# EasyEDA Pro project ProPrj_PFC_1_2025-03-30.epro

# Schematic Schematic1
Board Name: Board1; Create Date: 2025-03-03; Page Name: P1; Project Name: PFC_1; Schematic Name: Schematic1; Update Date: 2025-03-08; Company: 嘉立创EDA; Page Size: A4; Version: V1.0
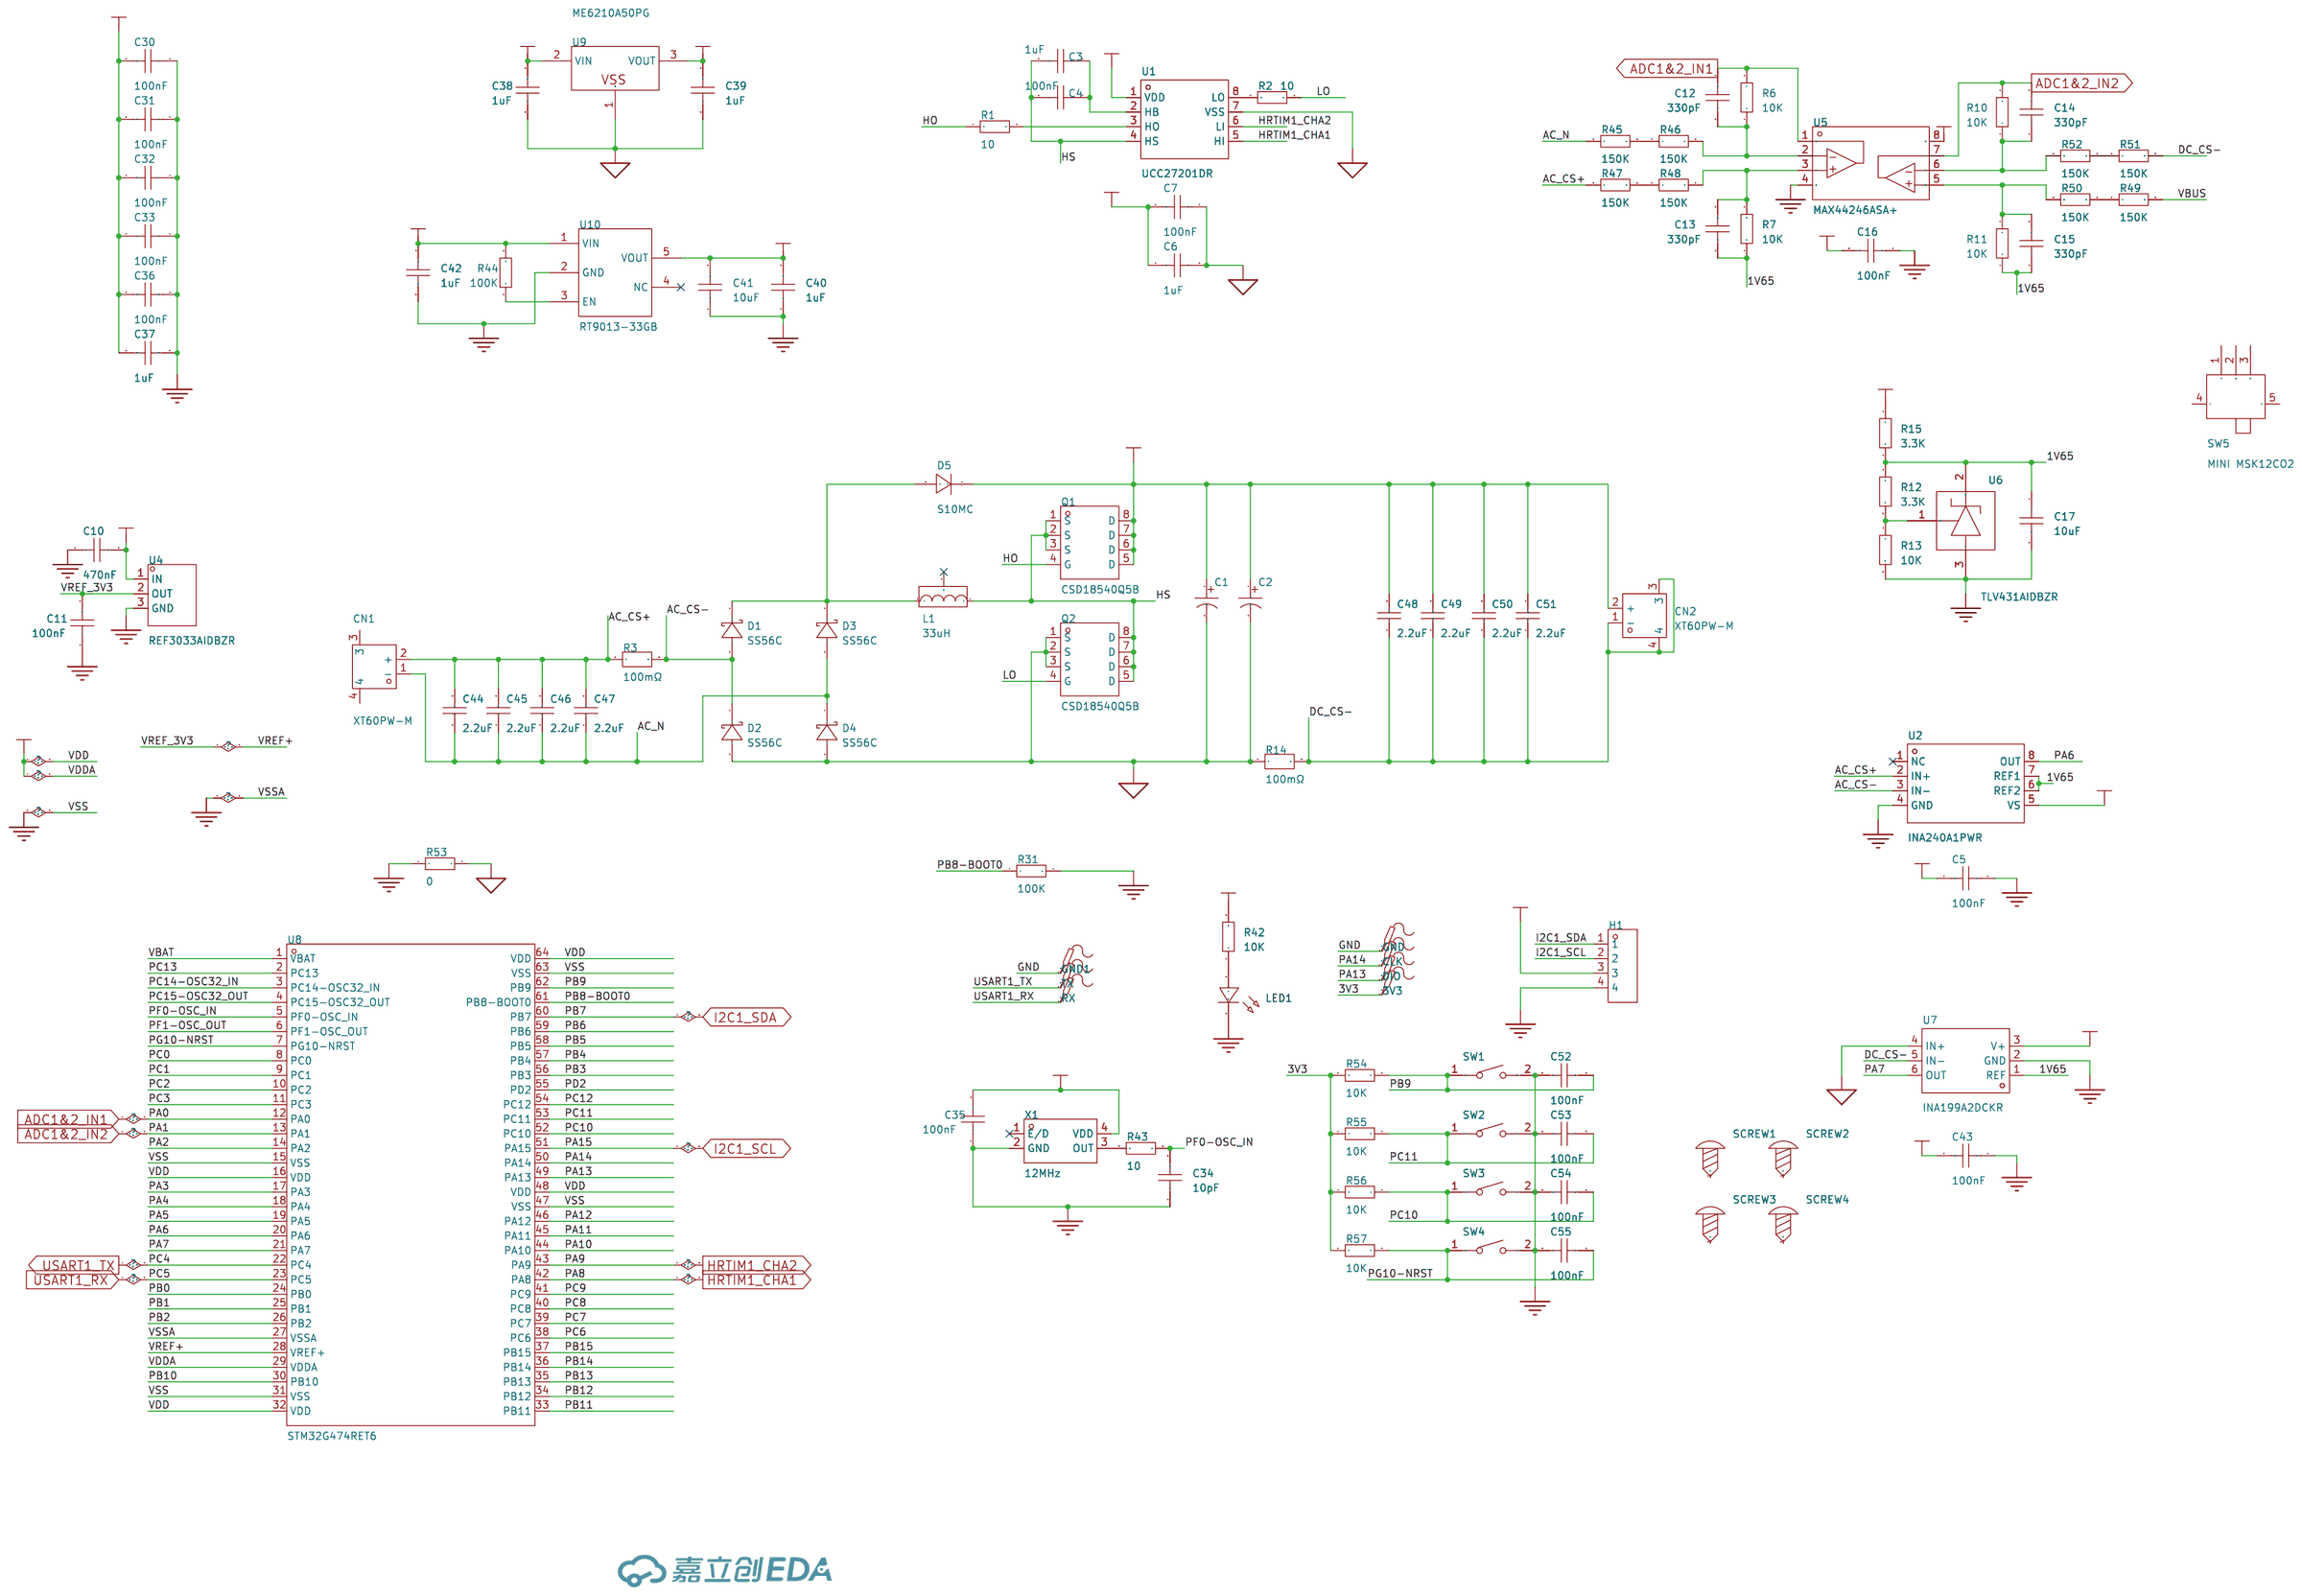
[diagram p0: schematic sheet]

## Parts
3V3  -  [Test-Point-0.5mm]
C1  680uF  [CAP-TH_BD12.5-P5.00-D0.6-FD]
C2  680uF  [CAP-TH_BD12.5-P5.00-D0.6-FD]
C3  1uF  [C0603]
C4  100nF  [C0603]
C5  100nF  [R0402]
C6  1uF  [C0603]
C7  100nF  [C0603]
C10  470nF  [R0402]
C11  100nF  [R0402]
C12  330pF  [R0402]
C13  330pF  [R0402]
C14  330pF  [R0402]
C15  330pF  [R0402]
C16  100nF  [R0402]
C17  10uF  [R0402]
C30  100nF  [R0402]
C31  100nF  [R0402]
C32  100nF  [R0402]
C33  100nF  [R0402]
C34  10pF  [R0402]
C35  100nF  [R0402]
C36  100nF  [R0402]
C37  1uF  [R0402]
C38  1uF  [C0603]
C39  1uF  [C0603]
C40  1uF  [C0603]
C41  10uF  [C0603]
C42  1uF  [C0603]
C43  100nF  [R0402]
C44  2.2uF  [C1206]
C45  2.2uF  [C1206]
C46  2.2uF  [C1206]
C47  2.2uF  [C1206]
C48  2.2uF  [C1206]
C49  2.2uF  [C1206]
C50  2.2uF  [C1206]
C51  2.2uF  [C1206]
C52  100nF  [R0402]
C53  100nF  [R0402]
C54  100nF  [R0402]
C55  100nF  [R0402]
CLK  -  [Test-Point-0.5mm]
CN1  XT60PW-M  [CONN-TH_XT60PW-M]
CN2  XT60PW-M  [CONN-TH_XT60PW-M]
D1  SS56C  [SMC_L6.9-W5.9-LS7.9-RD]
D2  SS56C  [SMC_L6.9-W5.9-LS7.9-RD]
D3  SS56C  [SMC_L6.9-W5.9-LS7.9-RD]
D4  SS56C  [SMC_L6.9-W5.9-LS7.9-RD]
D5  S10MC  [SMC_L7.1-W6.2-LS8.1-RD]
DIO  -  [Test-Point-0.5mm]
GND  -  [Test-Point-0.5mm]
GND1  -  [Test-Point-0.5mm]
H1  -  [HDR-TH_4P-P2.54-V-F]
L1  33uH  [IND-SMD_3P-L27.9-W19.7-P10.43-LS27.9-BL-A]
LED1  -  [LED_0402]
Q1  CSD18540Q5B  [VSON-CLIP-8_L5.0-W6.0-P1.27-BL]
Q2  CSD18540Q5B  [VSON-CLIP-8_L5.0-W6.0-P1.27-BL]
R1  10  [R0603]
R2  10  [R0603]
R3  100mΩ  [RES-SMD_L6.4-W3.2-R2512]
R6  10K  [R0402]
R7  10K  [R0402]
R10  10K  [R0402]
R11  10K  [R0402]
R12  3.3K  [R0402]
R13  10K  [R0402]
R14  100mΩ  [RES-SMD_L6.4-W3.2-R2512]
R15  3.3K  [R0402]
R31  100K  [R0402]
R42  10K  [R0402]
R43  10  [R0402]
R44  100K  [R0402]
R45  150K  [R0603]
R46  150K  [R0603]
R47  150K  [R0603]
R48  150K  [R0603]
R49  150K  [R0603]
R50  150K  [R0603]
R51  150K  [R0603]
R52  150K  [R0603]
R53  0  [R0603]
R54  10K  [R0402]
R55  10K  [R0402]
R56  10K  [R0402]
R57  10K  [R0402]
RX  -  [Test-Point-0.5mm]
SCREW1  -  [M2螺丝]
SCREW2  -  [M2螺丝]
SCREW3  -  [M2螺丝]
SCREW4  -  [M2螺丝]
SW1  TS-1088-AR02016  [SW-SMD_L3.9-W3.0-P4.45]
SW2  TS-1088-AR02016  [SW-SMD_L3.9-W3.0-P4.45]
SW3  TS-1088-AR02016  [SW-SMD_L3.9-W3.0-P4.45]
SW4  TS-1088-AR02016  [SW-SMD_L3.9-W3.0-P4.45]
SW5  MINI MSK12CO2  [SW-SMD_MSK12CO2]
TX  -  [Test-Point-0.5mm]
U1  UCC27201DR  [SOIC-8_L4.9-W3.9-P1.27-LS6.0-BL]
U2  INA240A1PWR  [TSSOP-8_L4.4-W3.0-P0.65-LS6.4-BL]
U4  REF3033AIDBZR  [SOT-23-3_L3.0-W1.7-P0.95-LS2.9-BR]
U5  MAX44246ASA+  [SOIC-8_L4.9-W3.9-P1.27-LS6.0-BL]
U6  TLV431AIDBZR  [SOT-23-3_L2.9-W1.3-P1.90-LS2.4-BR]
U7  INA199A2DCKR  [SOT-363_L2.0-W1.3-P0.65-LS2.1-BR]
U8  STM32G474RET6  [LQFP-64_L10.0-W10.0-P0.50-LS12.0-BL]
U9  ME6210A50PG  [SOT-89-3_L4.5-W2.5-P1.50-LS4.2-BR]
U10  RT9013-33GB  [SOT-23-5_L3.0-W1.7-P0.95-LS2.8-BL]
X1  12MHz  [OSC-SMD_4P-L2.5-W2.0-BL]

## Library data of the parts
3V3 CLK DIO GND GND1 RX TX = Test-Point: Test Point 测试点
C1 C2 = ERR1JM681W25OT: 容值:680uF;精度:±20%;额定电压:63V;; LCSC Part Name: 680uF ±20% 63V; Supplier Part: C106632; Manufacturer: AISHI(艾华集团); Supplier Footprint: 插件,D12.5xL25mm; JLCPCB Part Class: 扩展库; Datasheet: https://atta.szlcsc.com/upload/public/pdf/source/20190702/C401591_1676EF45BC9A88BD1D6B22BBAE3913C7.pdf; Supplier: LCSC; Tolerance: ±20%; Rated Voltage: 63V; Lead Spacing: 5mm; φD: 12.5mm; L: 25mm; Lifetime @ Temp: 2000hrs@105℃
C3 C4 C6 C7 C38-C42 = CAP_0603: Supplier Footprint: 0603
C5 C10-C17 C30-C37 C43 C52-C55 = CAP_0402: Supplier Footprint: 0402
C44-C51 = CL31B225KBHNNNE: 容值:2.2uF;精度:±10%;额定电压:50V;材质(温度系数):X7R;; LCSC Part Name: 2.2uF ±10% 50V; Supplier Part: C50254; Manufacturer: SAMSUNG(三星); Supplier Footprint: 1206; JLCPCB Part Class: 基础库; Datasheet: https://atta.szlcsc.com/upload/public/pdf/source/20160218/1457707763339.pdf; Supplier: LCSC; Tolerance: ±10%; Voltage Rated: 50V; Temperature Coefficient: X7R
CN1 CN2 = XT60PW-M: 类别:-;类型1:-;; LCSC Part Name: AMASS(艾迈斯)航模插头xt60连接器150公母对接pw锂电池公头 板插卧式XT60PW-M; Supplier Part: C98732; Manufacturer: AMASS(艾迈斯); JLCPCB Part Class: 扩展库; Datasheet: https://atta.szlcsc.com/upload/public/pdf/source/20240118/44A3DCFF53BE25DC65378AFFB21277A4.pdf; Supplier: LCSC; Brand: 艾迈斯; Type: 卧式插头; Colour: 黄色; InterfaceType: 公头
D1-D4 = SS56C_C18199187: 二极管配置:独立式;正向压降(Vf):680mV@5A;直流反向耐压(Vr):60V;平均整流电流(Io):5A;; LCSC Part Name: 电压:60V 电流:5A; Supplier Part: C18199187; Manufacturer: 宏迦橙; Supplier Footprint: SMC; JLCPCB Part Class: Extended Part; Datasheet: https://atta.szlcsc.com/upload/public/pdf/source/20230927/46983A3EB8DC257944F6920426E4503D.pdf; Supplier: LCSC; Diode Configuration: 独立式; Forward Voltage (Vf@If): 680mV@5A; Reverse Voltage (Vr): 60V; Average Rectified Current (Io): 5A; Reverse Leakage Current (Ir): 150uA@60V; Peak forward surge current: 120A
D5 = S10MC: 二极管配置:独立式;正向压降(Vf):1V@10A;直流反向耐压(Vr):1kV;整流电流:10A;; LCSC Part Name: 电压:1kV 电流:10A; Supplier Part: C64933; Manufacturer: MDD(辰达半导体); Supplier Footprint: SMC(DO-214AB); JLCPCB Part Class: 扩展库; Datasheet: https://atta.szlcsc.com/upload/public/pdf/source/20230314/1A4EE04768B6F73C910BD0715A0F0DB0.pdf; Supplier: LCSC; Diode Configuration: 独立式; Forward Voltage (Vf@If): 1V@10A; Reverse Voltage (Vr): 1kV; Rectified Current: 10A; Reverse Leakage Current: 5uA@1kV
H1 = HDR-F_2.54_1x4P: Supplier Part: C2718488; Supplier Footprint: 插件
L1 = RSPQ2918-100M: 电感值:10uH;精度:±20%;额定电流:28A;饱和电流(Isat):32.1A;类型:扁平线大电流电感;; LCSC Part Name: 扁线大电流电感; Supplier Part: C32712982; Manufacturer: Ruishen(瑞申电子); Supplier Footprint: SMD-3P,27.9x22.7mm; JLCPCB Part Class: 扩展库; Datasheet: https://atta.szlcsc.com/upload/public/pdf/source/20240726/0174FDFD11BDB39ACD924CDA9AAA1BCF.pdf; Supplier: LCSC; Tolerance: ±20%; Rated Current: 28A; Saturation Current (Isat): 32.1A; DC Resistance (DCR): 2.6mΩ; Type: 扁平线大电流电感
LED1 = LED_0402-B: Supplier Footprint: 0402
Q1 Q2 = CSD18540Q5B: 类型:1个N沟道;漏源电压(Vdss):60V;连续漏极电流(Id):205A;导通电阻(RDS(on)@Vgs,Id):2.6mΩ@10V,28A;功率(Pd):3.8W;阈值电压(Vgs(th)@Id):1.9V@250uA;; LCSC Part Name: 1个N沟道 耐压:60V 电流:205A; Supplier Part: C86513; Manufacturer: TI(德州仪器); Supplier Footprint: VSON-8(5x6); JLCPCB Part Class: 扩展库; Datasheet: https://www.ti.com/lit/ds/symlink/csd18540q5b.pdf?ts=1718590350466&ref_url=https%253A%252F%252Fwww.ti.com.cn%252Fproduct%252Fzh-cn%252FCSD18540Q5B%253FkeyMatch%253DCSD18540Q5B%2526tisearch%253Dsearch-everything%2526usecase%253DOPN; Supplier: LCSC; Type: 1个N沟道; Drain Source Voltage (Vdss): 60V; Continuous Drain Current (Id): 205A; Drain Source On Resistance (RDS(on)@Vgs,Id): 2.6mΩ@10V,28A; Power Dissipation (Pd): 3.8W; Gate Threshold Voltage (Vgs(th)@Id): 1.9V@250uA; Total Gate Charge (Qg@Vgs): 41nC@10V; Input Capacitance (Ciss@Vds): 4.23nF@30V; Reverse Transfer Capacitance (Crss@Vds): 20pF@30V; Operating Temperature: -55℃~+175℃
R1 R2 R45-R53 = Res_0603: Supplier Footprint: 0603
R3 R14 = HoJLR2512-3W-100mR-1%: 电阻类型:采样电阻;阻值:100mΩ;精度:±1%;功率:3W;安装方式:贴片;; LCSC Part Name: 100mΩ ±1% 3W; Supplier Part: C2903476; Manufacturer: Milliohm(毫欧); Supplier Footprint: 2512; JLCPCB Part Class: 扩展库; Datasheet: https://atta.szlcsc.com/upload/public/pdf/source/20211009/7525CABAB363C979E942C1DD41F1FEF0.pdf; Supplier: LCSC; Type: 采样电阻; Tolerance: ±1%; Power(Watts): 3W; Mounting Sytle: 贴片
R6 R7 R10-R13 R15 R31 R42-R44 R54-R57 = Res_0402: Supplier Footprint: 0402
SCREW1-SCREW4 = M2螺丝: Supplier Footprint: 插件
SW1-SW4 = TS-1088-AR02016: 电路结构:单刀单掷;按钮形状:圆形按钮;作用力:160gf;安装方式:立贴;开关长度:4mm;开关宽度:3mm;开关高度:2mm;带支架:不带;触点电流:50mA;额定电压(DC):12V;绝缘电阻:100MΩ;机械寿命:10万次;; LCSC Part Name: 4*3*2mm 立贴 轻触开关; Supplier Part: C720477; Manufacturer: XUNPU(讯普); Supplier Footprint: SMD; JLCPCB Part Class: 扩展库; Datasheet: https://atta.szlcsc.com/upload/public/pdf/source/20200810/C720475_60D09DD6C54279ADDB2DC25100F1CC11.pdf; Supplier: LCSC; Circuit: 单刀单掷; Actuator Style: 圆形按钮; Operating Force: 160gf; Mounting Style: 立贴; Switch Length: 4mm; Switch Width: 3mm; Switch Height: 2mm; Strike Gundam: 不带; Contact Current: 50mA; Voltage Rating (DC): 12V; Insulation Resistance: 100MΩ; Actuator/Cap Color: 黑色; Pin Style: SMD接片; Mechanical Life: 10万次; Operating Temperature: -30℃~+80℃
SW5 = MINI MSK12CO2: 电路结构:单刀双掷;安装方式:卧贴;开关颜色:-;额定电流(DC):50mA;额定电压(DC):12V;额定电流(AC):-;额定电压(AC):-;机械寿命:1万次;; LCSC Part Name: 迷你七脚两档侧拨拨动 mini七7脚 微型拨动; Supplier Part: C2681570; Manufacturer: SHOU HAN(首韩); Supplier Footprint: SMD; JLCPCB Part Class: 扩展库; Datasheet: https://atta.szlcsc.com/upload/public/pdf/source/20210224/C2681570_D263F9C605E4588A4AE6114B72AE4C72.pdf; Supplier: LCSC; Circuit: 单刀双掷; Pin Style: SMD接片; Switch Length: 5mm; Switch Width: 2.75mm; Switch Height: 1.4mm; Mounting Style: 卧贴; Current Rating (DC): 50mA; Voltage Rating (DC): 12V; Mechanical Life: 1万次; Operating Temperature: -16℃~+60℃
U1 = UCC27201DR: 驱动配置:半桥;负载类型:MOSFET;驱动通道数:2;峰值灌电流:3A;峰值拉电流:3A;电源电压:8V~17V;上升时间:8ns;下降时间:7ns;; Supplier Part: C47661; Manufacturer: TI(德州仪器); Supplier Footprint: SOIC-8; JLCPCB Part Class: 扩展库; Datasheet: https://www.ti.com/cn/lit/gpn/ucc27201; Supplier: LCSC; Driven Configuration: 半桥; Load Type: MOSFET; Number of Drivers: 2; Peak Output Current(sink): 3A; Peak Output Current(source): 3A; Supply Voltage: 8V~17V; Rise Time: 8ns; Fall Time: 7ns; Operating Temperature: -40℃~+140℃@(Tj)
U2 = INA240A1PWR: 放大器数:单路;; Supplier Part: C93965; Manufacturer: TI(德州仪器); Supplier Footprint: TSSOP-8; JLCPCB Part Class: 扩展库; Datasheet: https://www.ti.com/cn/lit/gpn/ina240; Supplier: LCSC; Number of Channels: 单路; Supply Current: 1.8mA; Operating Temperature: -40℃~+125℃
U4 = REF3033AIDBZR: 输出类型:固定;输入电压:3.35V~5.5V;输出电压:3.3V;输出电流:25mA;精度:±0.2%;; Supplier Part: C36658; Manufacturer: TI(德州仪器); Supplier Footprint: SOT-23; JLCPCB Part Class: 扩展库; Datasheet: https://www.ti.com/cn/lit/gpn/ref3020; Supplier: LCSC; Output Type: 固定; Input Voltage: 3.35V~5.5V; Output Voltage: 3.3V; Output Current: 25mA; Tolerance: ±0.2%; Temperature Coefficient: 75ppm/℃; Reference Type: 串联; Supply Current: 50uA; Noise - 10Hz to 10kHz: 105uVrms; Operating Temperature: -40℃~+125℃@(Ta)
U5 = MAX44246ASA+: 放大器数:双路;增益带宽积(GBP):5MHz;输入偏置电流(Ib):300pA;压摆率(SR):3.8V/us;带宽(-3db):-;轨到轨:-;; LCSC Part Name: MAX44246ASA; Supplier Part: C143473; Manufacturer: ADI(亚德诺)/MAXIM(美信); Supplier Footprint: SOIC-8; JLCPCB Part Class: 扩展库; Datasheet: https://atta.szlcsc.com/upload/public/pdf/source/20190626/C400168_58539801ADE717E00F7AF2A27F952E63.pdf; Supplier: LCSC; Number of Circuits: 双路; Gain Bandwidth Product(GBP): 5MHz; Current - Input Bias(Ib): 300pA; Slew Rate(SR): 3.8V/us; Output Current: 40mA; Operating Temperature: -40℃~+125℃
U6 = TLV431AIDBZR: 输出类型:可调;输出电压:1.24V~6V;输出电流:15mA;精度:±1%;; Supplier Part: C56765; Manufacturer: TI(德州仪器); Supplier Footprint: SOT-23; JLCPCB Part Class: 扩展库; Datasheet: https://www.ti.com/cn/lit/gpn/tlv431a; Supplier: LCSC; Output Type: 可调; Output Voltage: 1.24V~6V; Output Current: 15mA; Tolerance: ±1%; Reference Type: 并联; Minimum Cathode Current for Regulation: 80uA; Operating Temperature: -40℃~+85℃@(TA)
U7 = INA199A2DCKR: INA199 26V、双向电流感应放大器; Supplier Part: C131913; Manufacturer: TI(德州仪器); Supplier Footprint: SOT-363-6; JLCPCB Part Class: 扩展库; Datasheet: https://www.ti.com/cn/lit/gpn/ina199; Supplier: LCSC; Supply Voltage: -300mV~26V; Supply Current: 375uA; Operating Temperature: -40℃~+125℃
U8 = STM32G474RET6: CPU内核:ARM-M4;程序存储容量:512KB;RAM总容量:128KB;GPIO端口数量:52;工作电压范围:1.71V~3.6V;CPU最大主频:170MHz;程序存储器类型:FLASH;; LCSC Part Name: 带DSP和FPU的170MHz主流ARM Cortex-M4 MCU，具有512 KB Flash存储器、数学加速器、高分辨率定时器和高模拟电平集成; Supplier Part: C521608; Manufacturer: ST(意法半导体); Supplier Footprint: LQFP-64(10x10); JLCPCB Part Class: 扩展库; Datasheet: https://atta.szlcsc.com/upload/public/pdf/source/20200902/C431632_38212262685EE30B1989689374F08940.pdf; Supplier: LCSC; CPU Core: ARM-M4; Program Storage Size: 512KB; RAM Size: 128KB; GPIO Ports Number: 52; Operating Voltage Range: 1.71V~3.6V; CPU Maximum Speed: 170MHz; Program Memory Type: FLASH; Operating Temperature Range: -40℃~+85℃; ADC (Bit): 12bit; DAC (Bit): 12bit; Peripheral/Function: PWM；PWM; Internal Oscillator: 有
U9 = ME6210A50PG: 输出类型:固定;工作电压:18V;输出电压:5V;输出电流:500mA;电源纹波抑制比(PSRR):-;输出极性:正极;; LCSC Part Name: 输入18V 输出5V 500mA; Supplier Part: C82940; Manufacturer: MICRONE(南京微盟); Supplier Footprint: SOT-89-3; JLCPCB Part Class: 扩展库; Datasheet: https://atta.szlcsc.com/upload/public/pdf/source/20170316/1489630771676.pdf; Supplier: LCSC; Output Type: 固定; Voltage - Supply: 18V; Output Voltage: 5V; Output Current: 500mA; Voltage Dropout: 220mV@(200mA); Features: 短路保护(SCP)；低ESR; Output Configuration: 正极; Number of Outputs: 1
U10 = RT9013-33GB: 输出类型:固定;最大输入电压:5.5V;输出电压:3.3V;最大输出电流:500mA;电源纹波抑制比(PSRR):50dB@(10kHz);输出极性:正极;; LCSC Part Name: 输入5.5V 输出3.3V 500mA; Supplier Part: C47773; Manufacturer: RICHTEK(立锜); Supplier Footprint: SOT-23-5; JLCPCB Part Class: 扩展库; Datasheet: https://atta.szlcsc.com/upload/public/pdf/source/20150504/1457707282459.pdf; Supplier: LCSC; Output Type: 固定; Maximum Input Voltage: 5.5V; Output Voltage: 3.3V; MAX Output Current: 500mA; Power Supply Rejection Ratio (PSRR): 50dB@(10kHz); Dropout Voltage: 400mV@(500mA); standby current: 50uA; Operating Temperature: -40℃~+85℃; Output Polarity: 正极; Number of Outputs: 1
X1 = OT252012MJBA4SL: 频率:12MHz;工作电压:1.8V~3.3V;供电电流:4mA;频率稳定度(全温):±10ppm;; LCSC Part Name: 12MHz ±10ppm 1.8V~3.3V YSO110TR; Supplier Part: C669073; Manufacturer: YXC(扬兴晶振); Supplier Footprint: SMD2520-4P; JLCPCB Part Class: 扩展库; Datasheet: https://atta.szlcsc.com/upload/public/pdf/source/20210329/C669065_30B18CFE780D377BA4E84F6ED1951959.pdf; Supplier: LCSC; Supply Voltage: 1.8V~3.3V; Supply Current (Max): 4mA; Frequency Stability(Full temperature range): ±10ppm; Operating Temperature: -40℃~+85℃

## Nets
1V65: C13.1 C15.1 C17.1 R7.1 R11.1 R12.1 R15.2 U2.6(REF2) U2.7(REF1) U6.2(C) U7.1(REF)
3V3: 3V3.1 C30.2 C31.2 C32.2 C33.2 C35.2 C36.2 C37.2 C40.2 C41.2 R42.2 R54.1 R55.1 R56.1 R57.1 U8.16(VDD) U8.29(VDDA) U8.32(VDD) U8.48(VDD) U8.64(VDD) U10.5(VOUT) X1.4(VDD)
5V0: C5.1 C10.2 C16.2 C39.2 C42.2 C43.1 H1.3 R15.1 R44.2 U2.5(VS) U4.1(IN) U5.8(VDD) U7.3(V+) U9.3(VOUT) U10.1(VIN)
12V0: C6.1 C7.1 C38.2 U1.1(VDD) U9.2(VIN)
AGND: C1.2 C2.2 C6.2 C7.2 C38.1 C39.1 D2.2(A) D4.2(A) Q2.1(S) Q2.2(S) Q2.3(S) R14.1 R53.2 U1.7(VSS) U7.4(IN+) U9.1(VSS)
GND: C5.2 C10.1 C11.1 C16.1 C17.2 C30.1 C31.1 C32.1 C33.1 C34.1 C35.1 C36.1 C37.1 C40.1 C41.1 C42.1 C43.2 C52.1 C53.1 C54.1 C55.1 GND.1 GND1.1 H1.4 LED1.1(C) R13.2 R31.2 R53.1 SW1.2 SW2.2 SW3.2 SW4.2 U2.4(GND) U4.3(GND) U5.4(VSS) U6.3(A) U7.2(GND) U8.15(VSS) U8.27(VSSA) U8.31(VSS) U8.47(VSS) U8.63(VSS) U10.2(GND) X1.2(GND)
VBAT: U8.1(VBAT)
VBUS: C1.1 C2.1 C48.2 C49.2 C50.2 C51.2 CN2.2(+) D5.1(K) Q1.5(D) Q1.6(D) Q1.7(D) Q1.8(D) R49.2
AC_CS+: C44.2 C45.2 C46.2 C47.2 CN1.2(+) R3.1 R47.1 U2.2(IN+)
AC_CS-: D1.2(A) D2.1(K) R3.2 U2.3(IN-)
AC_N: C44.1 C45.1 C46.1 C47.1 CN1.1(-) D3.2(A) D4.1(K) R45.1
ADC1&2_IN1: C12.2 R6.2 U5.1(OUTA) U8.12(PA0)
ADC1&2_IN2: C14.2 R10.2 U5.7(OUTB) U8.13(PA1)
DC_CS-: C48.1 C49.1 C50.1 C51.1 CN2.1(-) CN2.3 CN2.4 R14.2 R51.2 U7.5(IN-)
HO: Q1.4(G) R1.1
HRTIM1_CHA1: U1.5(HI) U8.42(PA8)
HRTIM1_CHA2: U1.6(LI) U8.43(PA9)
HS: C3.1 C4.1 L1.2 Q1.1(S) Q1.2(S) Q1.3(S) Q2.5(D) Q2.6(D) Q2.7(D) Q2.8(D) U1.4(HS)
I2C1_SCL: H1.2 U8.51(PA15)
I2C1_SDA: H1.1 U8.60(PB7)
LO: Q2.4(G) R2.2
PA2: U8.14(PA2)
PA3: U8.17(PA3)
PA4: U8.18(PA4)
PA5: U8.19(PA5)
PA6: U2.8(OUT) U8.20(PA6)
PA7: U7.6(OUT) U8.21(PA7)
PA10: U8.44(PA10)
PA11: U8.45(PA11)
PA12: U8.46(PA12)
PA13: DIO.1 U8.49(PA13)
PA14: CLK.1 U8.50(PA14)
PB0: U8.24(PB0)
PB1: U8.25(PB1)
PB2: U8.26(PB2)
PB3: U8.56(PB3)
PB4: U8.57(PB4)
PB5: U8.58(PB5)
PB6: U8.59(PB6)
PB8-BOOT0: R31.1 U8.61(PB8-BOOT0)
PB9: C52.2 R54.2 SW1.1 U8.62(PB9)
PB10: U8.30(PB10)
PB11: U8.33(PB11)
PB12: U8.34(PB12)
PB13: U8.35(PB13)
PB14: U8.36(PB14)
PB15: U8.37(PB15)
PC0: U8.8(PC0)
PC1: U8.9(PC1)
PC2: U8.10(PC2)
PC3: U8.11(PC3)
PC4: TX.1 U8.22(PC4)
PC5: RX.1 U8.23(PC5)
PC6: U8.38(PC6)
PC7: U8.39(PC7)
PC8: U8.40(PC8)
PC9: U8.41(PC9)
PC10: C54.2 R56.2 SW3.1 U8.52(PC10)
PC11: C53.2 R55.2 SW2.1 U8.53(PC11)
PC12: U8.54(PC12)
PC13: U8.2(PC13)
PC14-OSC32_IN: U8.3(PC14-OSC32_IN)
PC15-OSC32_OUT: U8.4(PC15-OSC32_OUT)
PD2: U8.55(PD2)
PF0-OSC_IN: C34.2 R43.2 U8.5(PF0-OSC_IN)
PF1-OSC_OUT: U8.6(PF1-OSC_OUT)
PG10-NRST: C55.2 R57.2 SW4.1 U8.7(PG10-NRST)
VREF+: C11.2 U4.2(OUT) U8.28(VREF+)
$1N971: R1.2 U1.3(HO)
$1N1088: R2.1 U1.8(LO)
$1N1274: C3.2 C4.2 U1.2(HB)
$1N1915: D1.1(K) D3.1(K) D5.2(A) L1.1
$1N3971: C12.1 R6.1 R46.2 U5.2(INA-)
$1N3972: C13.2 R7.2 R48.2 U5.3(INA+)
$1N3974: C14.1 R10.1 R52.1 U5.6(INB-)
$1N3975: C15.2 R11.2 R50.1 U5.5(INB+)
$1N4175: R12.2 R13.1 U6.1(REF)
$1N6069: R43.1 X1.3(OUT)
$1N8242: R44.1 U10.3(EN)
$1N11631: R45.2 R46.1
$1N11681: R47.2 R48.1
$1N11805: R51.1 R52.2
$1N17930: R49.1 R50.2
$1N24564: LED1.2(A) R42.1

Not connected (* = marked no-connect by the designer): CN1 3 4; L1 3(NC)*; SCREW1 1; SCREW2 1; SCREW3 1; SCREW4 1; SW5 1 2 3 4 5; U2 1(NC)*; U10 4(NC)*; X1 1(E/D)*

# Board PCB1
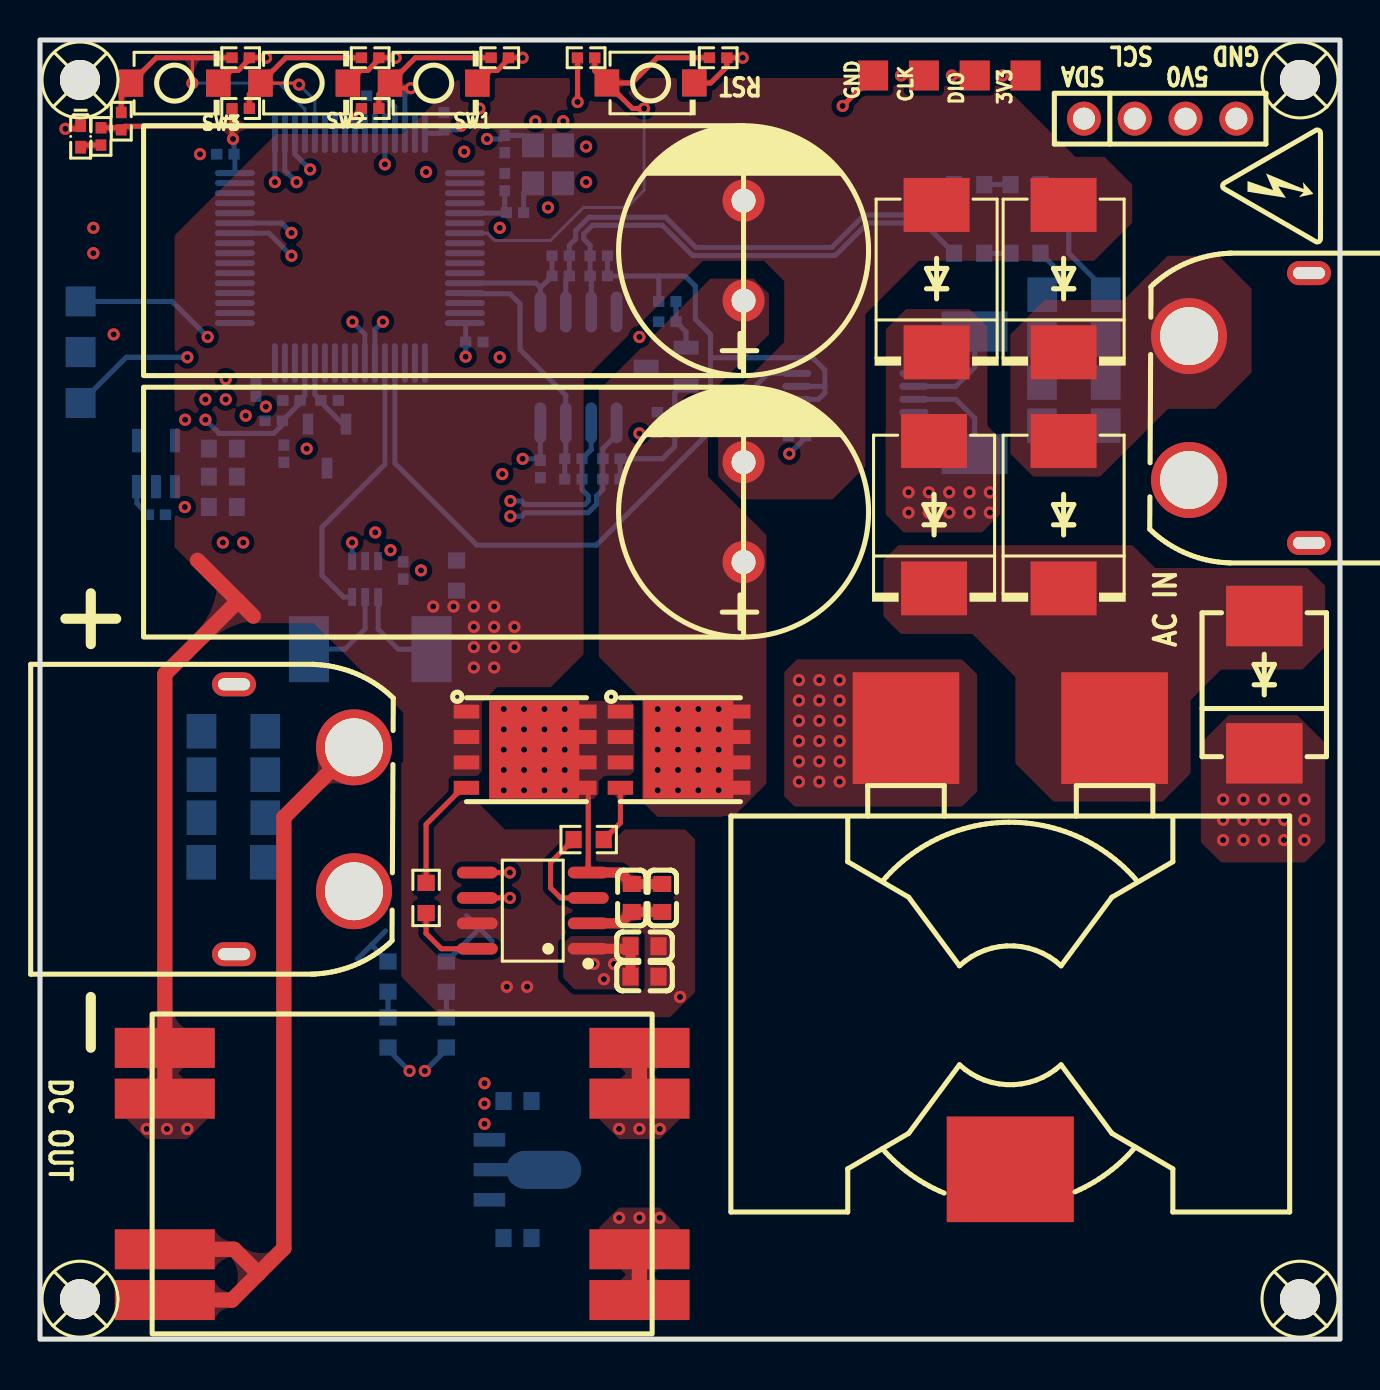
[diagram p1: board, top side]
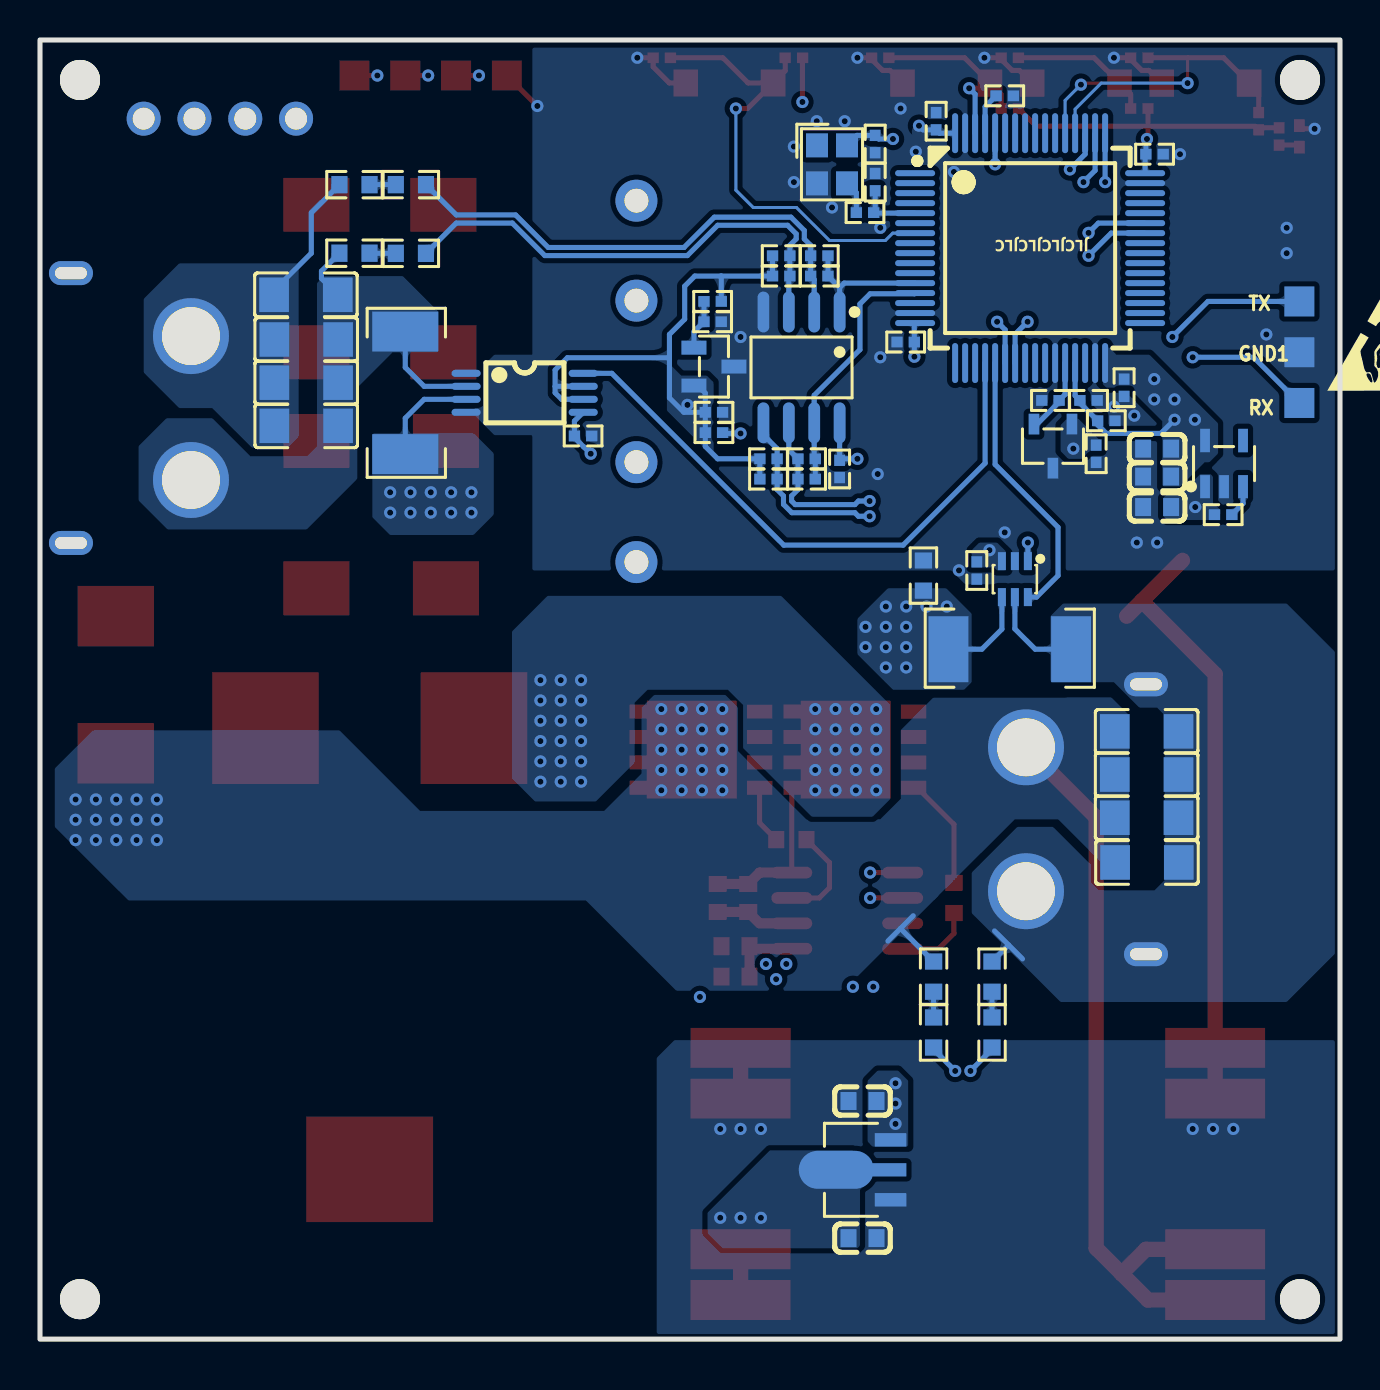
[diagram p2: board, bottom side, seen from below]

Outline 65 x 65 mm; copper layers: Top Layer, Inner1, Inner2, Bottom Layer. Coordinates in mm from the lower left corner of the outline.
Outline path: rectangle 0,65 65,0
Stack: Top Layer 0.035mm 外层铜厚1oz / Dielectric1 0.2104mm 7628 RC49% 8.6mil / Inner1 0.0152mm 内层铜厚 / Dielectric2 1.065mm 1.1mm H/HOZ Copper / Inner2 0.0152mm 内层铜厚 / Dielectric3 0.2104mm 7628 RC49% 8.6mil / Bottom Layer 0.035mm 外层铜厚1oz

## Design rules (mm)
net $1N3971: DP1
net $1N3972: DP1
net $1N3974: DP2
net $1N3975: DP2
template: 自定义配置
spacing copperThickness1oz (default): track to track 0.102, other pairs 0.152 to 0.3
spacing copperThickness2oz: track to track 0.203, other pairs 0.152 to 0.3
track width copperThickness1oz (default): min 0.127, default 0.254, max 2.54
track width copperThickness2oz: min 0.203, default 0.254, max 2.54
differential pair differentialPair (default): width min 0.127, default 0.254, max 2.54; gap min 0.152, default 0.152
via viaSize (default): diameter min 0.5, default 0.61, max 10; hole min 0.3, default 0.305, max 6.3

## Placement (name value [footprint] x y rotation side)
3V3  -  [Test-Point-0.5mm]  49.28 63.22 270 top
C1  680uF  [CAP-TH_BD12.5-P5.00-D0.6-FD]  35.18 54.46 90 top
C2  680uF  [CAP-TH_BD12.5-P5.00-D0.6-FD]  35.18 41.38 90 top
C3  1uF  [C0603]  29.59 22.07 270 top
C4  100nF  [C0603]  31.11 22.07 270 top
C5  100nF  [R0402]  37.85 45.19 180 bottom
C6  1uF  [C0603]  30.23 18.14 0 top
C7  100nF  [C0603]  30.23 19.66 0 top
C10  470nF  [R0402]  12.19 44.3 90 bottom
C11  100nF  [R0402]  14.48 46.97 180 bottom
C12  330pF  [R0402]  26.03 53.19 180 bottom
C13  330pF  [R0402]  27.94 53.19 180 bottom
C14  330pF  [R0402]  26.67 43.03 180 bottom
C15  330pF  [R0402]  28.57 43.03 180 bottom
C16  100nF  [R0402]  25.02 43.54 90 bottom
C17  10uF  [R0402]  31.3 46.37 180 bottom
C30  100nF  [R0402]  20.19 60.94 270 bottom
C31  100nF  [R0402]  21.72 49.89 180 bottom
C32  100nF  [R0402]  9.27 59.28 0 bottom
C33  100nF  [R0402]  10.79 47.6 90 bottom
C34  10pF  [R0402]  23.24 57.89 270 bottom
C35  100nF  [R0402]  23.24 59.79 90 bottom
C36  100nF  [R0402]  12.57 46.97 0 bottom
C37  1uF  [R0402]  11.68 45.95 0 bottom
C38  1uF  [C0603]  23.88 5.06 0 bottom
C39  1uF  [C0603]  23.88 11.91 180 bottom
C40  1uF  [C0603]  9.14 43.16 180 bottom
C41  10uF  [C0603]  9.14 44.55 180 bottom
C42  1uF  [C0603]  9.14 41.63 180 bottom
C43  100nF  [R0402]  18.16 38.46 270 bottom
C44  2.2uF  [C1206]  51.7 52.25 180 bottom
C45  2.2uF  [C1206]  51.69 50.01 180 bottom
C46  2.2uF  [C1206]  51.69 47.86 180 bottom
C47  2.2uF  [C1206]  51.69 45.7 180 bottom
C48  2.2uF  [C1206]  9.65 23.85 0 bottom
C49  2.2uF  [C1206]  9.67 26.09 0 bottom
C50  2.2uF  [C1206]  9.67 28.25 0 bottom
C51  2.2uF  [C1206]  9.67 30.41 0 bottom
C52  100nF  [R0402]  22.99 64.11 180 top
C53  100nF  [R0402]  16.51 64.11 180 top
C54  100nF  [R0402]  10.03 64.11 180 top
C55  100nF  [R0402]  33.91 64.11 180 top
CLK  -  [Test-Point-0.5mm]  44.2 63.22 270 top
CN1  XT60PW-M  [CONN-TH_XT60PW-M]  60.45 46.59 180 top
CN2  XT60PW-M  [CONN-TH_XT60PW-M]  12.7 26.01 0 top
D1  SS56C  [SMC_L6.9-W5.9-LS7.9-RD]  44.7 41.25 90 top
D2  SS56C  [SMC_L6.9-W5.9-LS7.9-RD]  44.83 53.06 90 top
D3  SS56C  [SMC_L6.9-W5.9-LS7.9-RD]  51.18 41.25 90 top
D4  SS56C  [SMC_L6.9-W5.9-LS7.9-RD]  51.18 53.06 90 top
D5  S10MC  [SMC_L7.1-W6.2-LS8.1-RD]  61.21 32.74 90 top
DIO  -  [Test-Point-0.5mm]  46.74 63.22 270 top
GND  -  [Test-Point-0.5mm]  41.66 63.22 270 top
GND1  -  [Test-Point-0.5mm]  2.03 49.38 180 bottom
H1  -  [HDR-TH_4P-P2.54-V-F]  56.01 61.06 0 top
L1  33uH  [IND-SMD_3P-L27.9-W19.7-P10.43-LS27.9-BL-A]  48.51 19.53 180 top
LED1  -  [LED_0402]  2.03 60.17 270 top
NOREF  -  [Pad_e476]  6.24 4.5 0 top
NOREF#2  -  [Pad_e478]  29.97 4.5 180 top
NOREF#3  -  [Pad_e475]  6.24 1.96 0 top
NOREF#4  -  [Pad_e473]  6.24 14.57 0 top
NOREF#5  -  [Pad_e480]  29.97 14.57 180 top
NOREF#6  -  [Pad_e479]  29.97 12.03 180 top
NOREF#7  -  [Pad_e477]  29.97 1.96 180 top
NOREF#8  -  [Pad_e474]  6.24 12.03 0 top
Q1  CSD18540Q5B  [VSON-CLIP-8_L5.0-W6.0-P1.27-BL]  32.02 29.49 270 top
Q2  CSD18540Q5B  [VSON-CLIP-8_L5.0-W6.0-P1.27-BL]  24.32 29.49 270 top
R1  10  [R0603]  27.43 25 180 top
R2  10  [R0603]  19.3 22.07 90 top
R3  100mΩ  [RES-SMD_L6.4-W3.2-R2512]  46.74 47.35 270 bottom
R6  10K  [R0402]  26.03 54.2 180 bottom
R7  10K  [R0402]  27.94 54.2 180 bottom
R10  10K  [R0402]  26.67 44.05 180 bottom
R11  10K  [R0402]  28.57 44.05 180 bottom
R12  3.3K  [R0402]  31.37 51.92 0 bottom
R13  10K  [R0402]  31.37 50.9 180 bottom
R14  100mΩ  [RES-SMD_L6.4-W3.2-R2512]  16.51 34.52 180 bottom
R15  3.3K  [R0402]  31.3 45.36 0 bottom
R31  100K  [R0402]  16.76 62.21 180 bottom
R42  10K  [R0402]  3.05 60.17 90 top
R43  10  [R0402]  23.75 56.36 180 bottom
R44  100K  [R0402]  5.84 41.25 0 bottom
R45  150K  [R0603]  49.28 57.76 180 bottom
R46  150K  [R0603]  46.46 57.76 180 bottom
R47  150K  [R0603]  49.28 54.33 180 bottom
R48  150K  [R0603]  46.46 54.32 180 bottom
R49  150K  [R0603]  20.32 18.14 90 bottom
R50  150K  [R0603]  20.32 15.34 90 bottom
R51  150K  [R0603]  17.4 18.14 90 bottom
R52  150K  [R0603]  17.4 15.34 90 bottom
R53  0  [R0603]  20.83 38.2 270 bottom
R54  10K  [R0402]  16.51 61.57 0 top
R55  10K  [R0402]  10.03 61.57 0 top
R56  10K  [R0402]  4.06 60.94 90 top
R57  10K  [R0402]  27.31 64.11 0 top
RX  -  [Test-Point-0.5mm]  2.03 46.84 180 bottom
SCREW1  -  [M2螺丝]  2 63 0 top
SCREW2  -  [M2螺丝]  63 63 0 top
SCREW3  -  [M2螺丝]  2 2 0 top
SCREW4  -  [M2螺丝]  63 2 0 top
SW1  TS-1088-AR02016  [SW-SMD_L3.9-W3.0-P4.45]  19.69 62.84 0 top
SW2  TS-1088-AR02016  [SW-SMD_L3.9-W3.0-P4.45]  13.21 62.84 0 top
SW3  TS-1088-AR02016  [SW-SMD_L3.9-W3.0-P4.45]  6.73 62.84 0 top
SW4  TS-1088-AR02016  [SW-SMD_L3.9-W3.0-P4.45]  30.53 62.85 0 top
TX  -  [Test-Point-0.5mm]  2.03 51.92 180 bottom
U1  UCC27201DR  [SOIC-8_L4.9-W3.9-P1.27-LS6.0-BL]  24.64 21.44 90 top
U2  INA240A1PWR  [TSSOP-8_L4.4-W3.0-P0.65-LS6.4-BL]  40.77 47.35 270 bottom
U4  REF3033AIDBZR  [SOT-23-3_L3.0-W1.7-P0.95-LS2.9-BR]  14.35 44.68 90 bottom
U5  MAX44246ASA+  [SOIC-8_L4.9-W3.9-P1.27-LS6.0-BL]  26.92 48.62 0 bottom
U6  TLV431AIDBZR  [SOT-23-3_L2.9-W1.3-P1.90-LS2.4-BR]  31.3 48.66 0 bottom
U7  INA199A2DCKR  [SOT-363_L2.0-W1.3-P0.65-LS2.1-BR]  16.26 38.03 90 bottom
U8  STM32G474RET6  [LQFP-64_L10.0-W10.0-P0.50-LS12.0-BL]  15.49 54.59 270 bottom
U9  ME6210A50PG  [SOT-89-3_L4.5-W2.5-P1.50-LS4.2-BR]  23.83 8.47 180 bottom
U10  RT9013-33GB  [SOT-23-5_L3.0-W1.7-P0.95-LS2.8-BL]  5.8 43.81 180 bottom
X1  12MHz  [OSC-SMD_4P-L2.5-W2.0-BL]  25.4 58.78 270 bottom

## Footprints (pads in the part's own frame, mm; a bottom-side part is the same pattern mirrored in y, then rotated)
C0603
  rect 0.8x0.9 smd: 1(-0.7,0) 2(0.7,0)
C1206
  rect 1.485x1.728 smd: 1(-1.593,0) 2(1.593,0)
CAP-TH_BD12.5-P5.00-D0.6-FD
  round 2.1 hole 1.2: 1(-2.5,0) 2(2.5,0)
CONN-TH_XT60PW-M
  round 3.8 hole 2.9: 1(3,-3.6) 2(3,3.6)
  oval 2.2x1.2 hole 1.6x0.6: 3(-3,6.75) 4(-3,-6.75)
HDR-TH_4P-P2.54-V-F
  round 1.7 hole 1.1: 1(-3.81,0) 2(-1.27,0) 3(1.27,0) 4(3.81,0)
IND-SMD_3P-L27.9-W19.7-P10.43-LS27.9-BL-A
  rect 5.33x5.59 smd: 1(-5.215,-11.037) 2(5.215,-11.037)
  rect 6.35x5.28 smd: 3(0,11.037)
LED_0402
  rect 0.637x0.541 smd: 1(-0.538,0) 2(0.538,0)
LQFP-64_L10.0-W10.0-P0.50-LS12.0-BL
  oval 0.3x2 smd: 1(-3.75,-5.75) 2(-3.25,-5.75) 3(-2.75,-5.75) 4(-2.25,-5.75) 5(-1.75,-5.75) 6(-1.25,-5.75) 7(-0.75,-5.75) 8(-0.25,-5.75) 9(0.25,-5.75) 10(0.75,-5.75) 11(1.25,-5.75) 12(1.75,-5.75) 13(2.25,-5.75) 14(2.75,-5.75) 15(3.25,-5.75) 16(3.75,-5.75) 33(3.75,5.75) 34(3.25,5.75) 35(2.75,5.75) 36(2.25,5.75) 37(1.75,5.75) 38(1.25,5.75) 39(0.75,5.75) 40(0.25,5.75) 41(-0.25,5.75) 42(-0.75,5.75) 43(-1.25,5.75) 44(-1.75,5.75) 45(-2.25,5.75) 46(-2.75,5.75) 47(-3.25,5.75) 48(-3.75,5.75)
  oval 2x0.3 smd: 17(5.75,-3.75) 18(5.75,-3.25) 19(5.75,-2.75) 20(5.75,-2.25) 21(5.75,-1.75) 22(5.75,-1.25) 23(5.75,-0.75) 24(5.75,-0.25) 25(5.75,0.25) 26(5.75,0.75) 27(5.75,1.25) 28(5.75,1.75) 29(5.75,2.25) 30(5.75,2.75) 31(5.75,3.25) 32(5.75,3.75) 49(-5.75,3.75) 50(-5.75,3.25) 51(-5.75,2.75) 52(-5.75,2.25) 53(-5.75,1.75) 54(-5.75,1.25) 55(-5.75,0.75) 56(-5.75,0.25) 57(-5.75,-0.25) 58(-5.75,-0.75) 59(-5.75,-1.25) 60(-5.75,-1.75) 61(-5.75,-2.25) 62(-5.75,-2.75) 63(-5.75,-3.25) 64(-5.75,-3.75)
M2螺丝
  round 2 hole 2: 1(0,0)
OSC-SMD_4P-L2.5-W2.0-BL
  rect 1.2x1.1 smd: 1(-0.95,-0.75) 2(0.95,-0.75) 3(0.95,0.75) 4(-0.95,0.75)
Pad_e473
  rect 5x2 smd: 1(0,0)
Pad_e474
  rect 5x2 smd: 1(0,0)
Pad_e475
  rect 5x2 smd: 1(0,0)
Pad_e476
  rect 5x2 smd: 1(0,0)
Pad_e477
  rect 5x2 smd: 1(0,0)
Pad_e478
  rect 5x2 smd: 1(0,0)
Pad_e479
  rect 5x2 smd: 1(0,0)
Pad_e480
  rect 5x2 smd: 1(0,0)
R0402
  rect 0.566x0.54 smd: 1(-0.433,0) 2(0.433,0)
R0603
  rect 0.806x0.864 smd: 1(-0.753,0) 2(0.753,0)
RES-SMD_L6.4-W3.2-R2512
  rect 2x3.3 smd: 1(-3.067,0) 2(3.067,0)
SMC_L6.9-W5.9-LS7.9-RD
  rect 2.7x3.3 smd: 1(-3.687,0) 2(3.687,0)
SMC_L7.1-W6.2-LS8.1-RD
  rect 3.03x3.82 smd: 1(-3.435,0) 2(3.435,0)
SOIC-8_L4.9-W3.9-P1.27-LS6.0-BL
  oval 0.588x2.045 smd: 1(-1.905,-2.772) 2(-0.635,-2.772) 3(0.635,-2.772) 4(1.905,-2.772) 5(1.905,2.772) 6(0.635,2.772) 7(-0.635,2.772) 8(-1.905,2.772)
SOT-23-3_L2.9-W1.3-P1.90-LS2.4-BR
  rect 1.25x0.7 smd: 1(1,-0.95) 2(1,0.95) 3(-1,0)
SOT-23-3_L3.0-W1.7-P0.95-LS2.9-BR
  rect 1.038x0.532 smd: 1(1.101,-0.95) 2(1.101,0.95) 3(-1.101,0)
SOT-23-5_L3.0-W1.7-P0.95-LS2.8-BL
  rect 0.49x1.157 smd: 1(-0.95,-1.153) 2(0,-1.153) 3(0.95,-1.153)
  rect 0.49x1.175 smd: 4(0.95,1.153) 5(-0.95,1.153)
SOT-89-3_L4.5-W2.5-P1.50-LS4.2-BR
  rect 1.575x0.672 smd: 1(1.356,-1.5) 3(1.356,1.5)
  custom 5.377x1.9 smd: 2(-1.356,0)
SOT-363_L2.0-W1.3-P0.65-LS2.1-BR
  rect 0.9x0.4 smd: 1(0.9,-0.65) 2(0.9,0) 3(0.9,0.65) 4(-0.9,0.65) 5(-0.9,0) 6(-0.9,-0.65)
SW-SMD_L3.9-W3.0-P4.45
  rect 1.23x1.36 smd: 1(-2.185,0) 2(2.185,0)
Test-Point-0.5mm
  rect 1.5x1.5 smd: 1(0,0)
TSSOP-8_L4.4-W3.0-P0.65-LS6.4-BL
  oval 0.353x1.454 smd: 1(-0.975,-2.927) 2(-0.325,-2.927) 3(0.325,-2.927) 4(0.975,-2.927) 5(0.975,2.927) 6(0.325,2.927) 7(-0.325,2.927) 8(-0.975,2.927)
VSON-CLIP-8_L5.0-W6.0-P1.27-BL
  rect 0.7x1.27 smd: 1(-1.904,-3) 2(-0.636,-3) 3(0.636,-3) 4(1.906,-3)
  rect 0.7x1 smd: 5(1.904,3) 6(0.634,3) 7(-0.636,3) 8(-1.906,3)
  rect 4.9x4.5 smd: 8(-0.001,0.39)

## Nets
As in the schematic, except:
12V0: C6.1 C7.1 C38.2 NOREF#2.1 NOREF#7.1 U1.1 U9.2
AGND: C1.2 C2.2 C6.2 C7.2 C38.1 C39.1 D2.2 D4.2 NOREF#4.1 NOREF#5.1 NOREF#6.1 NOREF#8.1 Q2.1 Q2.2 Q2.3 R14.1 R53.2 U1.7 U7.4 U9.1
VBUS: C1.1 C2.1 C48.2 C49.2 C50.2 C51.2 CN2.2 D5.1 NOREF.1 NOREF#3.1 Q1.5 Q1.6 Q1.7 Q1.8 R49.2

Pads without a net: CN1 3 4; L1 3; SCREW1 1; SCREW2 1; SCREW3 1; SCREW4 1; U2 1; U10 4; X1 1

## Via types
v1: diameter 0.61, hole 0.305, Top Layer to Bottom Layer, 182 vias

## Routing (per net, layer and track width the routed paths; a pad name or vN(x,y) marks a point on that pad's centre or on a via; arc(x,y) is an arc through that point)
1V65: length 56.7
  Inner1 w0.254: v1(32.63,46.74) 32.63,44.8 25.65,37.82 16.38,37.82 15.61,38.6 v1(15.61,39.85)
  Bottom Layer w0.254: U2.7 39.24,47.67 ; 39.24,47.67 39.24,47.35 38.92,47.02 U2.6 ; 39.24,47.67 39.24,48.49 38.63,49.1 33.53,49.1 ; C15.1 R11.1 31.11,44.05 31.74,44.67 R15.2 C17.1 ; 15.61,38.92 v1(15.61,39.85) ; 30.94,53.19 C13.1 R7.1 ; 30.94,53.19 R12.1 ; 30.94,53.19 32.26,53.19 32.77,52.68 32.77,51.03 33.53,50.27 33.53,49.1 ; 33.53,49.1 33.53,47.09 32.81,46.37 C17.1 ; C17.1 31.74,47.33 32.11,47.71 U6.2
3V3: length 49.5
  Top Layer w0.254: R57.1 26.88,64.1 v1(26.88,61.9) ; 9.6,60.68 4.24,60.68 R56.1 3.96,60.61 R42.2 ; 9.6,60.68 9.6,60.1 v1(9.65,60.05) ; 9.6,60.68 R55.1 ; 9.6,60.68 15.19,60.68 R54.1 ; v1(48.13,63.22) 3V3.1
  Inner1 w0.254: v1(48.13,63.22) 45.97,61.06 33.78,61.06
  Bottom Layer w0.254: v1(21.05,60.71) 20.84,60.5 C30.2 20.03,60.34 U8.64 ; U8.16 21.28,50.8 C31.2 21.28,49.16 v1(21.28,49.15) ; U8.48 9.74,59.24 9.7,59.28 9.7,60 v1(9.65,60.05) ; U8.29 13.24,47.2 C36.2 13.01,46.84 C37.2 12.12,45.75 11.68,45.31 8.96,45.31 v1(8.27,46) ; X1.4 24.15,60.23 C35.2 23.06,60.05 v1(22.35,60.05)
  vias: v1(7.26,46) v1(8.27,47.02) v1(9.29,48.03) v1(9.29,47.02)
5V0: length 70.7
  Inner1 w0.254: 41.28,54.71 41.28,58.52
  Inner1 w0.762: v1(22.22,11.79) v1(22.22,12.8) ; v1(22.22,11.79) 13.72,11.79 7.24,18.26 7.24,41.25 ; v1(22.22,11.79) v1(22.22,10.77) ; 41.28,56.49 52.7,56.49 H1.3
  Bottom Layer w0.254: v1(37.47,44.3) 37.81,44.64 37.81,44.64 38.28,45.11 C5.1 38.28,45.93 U2.5 ; v1(24.13,44.05) 24.94,44.05 C16.2 U5.8 ; 30.87,45.36 30.83,45.31 v1(29.97,45.31)
  vias: v1(7.24,41.63) v1(13.34,44.55) v1(17.53,39.47)
12V0: length 21.6
  Top Layer w0.508: 29.53,18.14 29.53,19.66 29.4,19.53 U1.1
  Top Layer w0.762: NOREF#7.1 NOREF#2.1
  Inner1 w0.762: v1(28.96,6.07) v1(29.97,6.07) ; v1(29.97,6.07) v1(30.99,6.07) ; v1(29.97,6.07) 29.97,7.72 27.43,10.26 27.43,16.36 28.19,17.12 v1(28.19,18.01)
  vias: v1(27.69,18.77) v1(28.7,18.77)
AGND: length 37.6
  Top Layer w0.762: NOREF#8.1 NOREF#4.1 6.24,33.27 9.91,36.93 ; 7.87,38.97 9.91,36.93 ; 9.91,36.93 10.67,36.17 ; NOREF#6.1 NOREF#5.1
  Bottom Layer w0.254: U7.4 16.91,35.52 17.91,34.52 R14.1
  vias: v1(5.33,10.52) v1(6.35,10.52) v1(7.37,10.52) v1(19.66,36.65) v1(20.68,36.65) v1(21.69,36.65) v1(21.69,35.64) v1(21.69,34.62) v1(21.69,33.61) v1(22.71,36.65) v1(22.71,35.64) v1(22.71,34.62) v1(22.71,33.61) v1(23.34,17.63) v1(23.72,35.64) v1(23.72,34.62) v1(24.36,17.63) v1(28.96,10.52) v1(29.97,10.52) v1(30.99,10.52) v1(32,17.12)
GND: length 39.5
  Top Layer w0.254: SW2.2 16.03,63.48 16.39,63.48 16.94,64.03 C53.1 v1(17.78,64.11) ; v1(24.13,64.11) C52.1 23.42,64.03 22.87,63.48 22.5,63.48 SW1.2 ; v1(11.3,64.11) C54.1 10.47,64.03 9.91,63.48 9.55,63.48 SW3.2 ; v1(35.13,64.11) C55.1 34.34,63.66 33.54,62.85 32.71,62.85 ; v1(1.27,60.56) 1.87,60.56 LED1.1 ; GND.1 v1(40.13,61.7)
  Inner2 w0.254: 40.39,55.09 40.39,58.4
  Inner2 w0.762: 40.39,56.62 54.99,56.62 59.44,61.06 H1.4
  vias: v1(2.67,55.6) v1(2.67,54.33) v1(3.68,50.27) v1(8,59.28) v1(9.14,39.85) v1(10.16,39.85) v1(10.29,46.2) v1(11.29,46.66) v1(16.76,40.36) v1(19.05,38.46) v1(19.3,58.4) v1(21.21,59.41) v1(21.97,61.57) v1(22.99,55.6) v1(22.99,49.12) v1(23.11,43.28) v1(24.76,60.94) v1(25.4,56.62) v1(26.16,60.94) v1(27.31,59.67) v1(27.31,57.89) v1(29.97,50.14)
VBUS: length 42.9
  Top Layer w0.762: 10.92,3.28 12.19,4.55 12.19,26.1 15.7,29.61 ; 10.92,3.28 9.6,1.96 NOREF#3.1 ; 10.92,3.28 9.7,4.5 NOREF.1
  Bottom Layer w0.254: 21.34,21.19 21.97,20.55 ; 21.97,20.55 22.61,19.92 ; 21.97,20.55 21.97,20.54 R49.2
  vias: v1(30.88,31.52) v1(30.88,30.51) v1(30.88,29.49) v1(30.88,28.48) v1(30.88,27.46) v1(31.9,31.52) v1(31.9,30.51) v1(31.9,29.49) v1(31.9,28.48) v1(31.9,27.46) v1(32.92,31.52) v1(32.92,30.51) v1(32.92,29.49) v1(32.92,28.48) v1(32.92,27.46) v1(33.93,31.52) v1(33.93,30.51) v1(33.93,29.49) v1(33.93,28.48) v1(33.93,27.46) v1(59.16,27) v1(59.16,25.99) v1(59.16,24.97) v1(60.17,27) v1(60.17,25.99) v1(60.17,24.97) v1(61.19,27) v1(61.19,25.99) v1(61.19,24.97) v1(62.2,27) v1(62.2,25.99) v1(62.2,24.97) v1(63.22,27) v1(63.22,25.99) v1(63.22,24.97)
AC_CS+: length 8
  Bottom Layer w0.254: R47.1 50.93,53.43 50.93,53.07 50.11,52.25 ; R3.1 46.74,48.62 45.79,47.67 U2.2
AC_CS-: length 5.2
  Bottom Layer w0.254: R3.2 46.74,46.08 45.79,47.02 U2.3
  vias: v1(43.43,42.37) v1(43.43,41.35) v1(44.44,42.37) v1(44.44,41.35) v1(45.46,42.37) v1(45.46,41.35) v1(46.48,42.37) v1(46.48,41.35) v1(47.49,42.37) v1(47.49,41.35)
AC_N: length 6.9
  Bottom Layer w0.254: C44.1 53.3,52.47 51.44,54.33 51.44,56.36 R45.1
ADC1&2_IN1: length 6.9
  Bottom Layer w0.254: 25.02,52.61 C12.2 R6.2 ; 25.02,52.61 U5.1 ; 25.02,52.61 24.79,52.84 U8.12
ADC1&2_IN2: length 12.7
  Bottom Layer w0.254: U8.13 21.28,52.3 23.5,52.3 24,51.79 24,49.51 26.29,47.22 U5.7 26.29,44.1 R10.2 C14.2
DC_CS-: length 8
  Bottom Layer w0.254: U7.5 16.26,35.54 15.24,34.52 R14.2 ; 16.57,19.72 17.27,20.42 ; 16.57,19.72 15.88,19.03 ; 16.57,19.72 R51.2
HO: length 2.9
  Top Layer w0.254: Q1.4 29.02,25.83 R1.1
HRTIM1_CHA1: length 52.1
  Top Layer w0.254: U1.5 v1(23.5,23.34)
  Inner2 w0.254: v1(23.5,23.34) 19.94,26.9 12.06,26.9 5.33,33.63 5.33,49 10.54,54.2 v1(12.57,54.2)
  Bottom Layer w0.254: U8.42 11.44,55.34 v1(12.57,54.2)
HRTIM1_CHA2: length 55.8
  Top Layer w0.254: U1.6 v1(23.5,22.07)
  Inner2 w0.254: v1(12.57,55.35) 9.78,55.35 4.32,49.89 4.32,32.87 11.81,25.38 20.19,25.38 v1(23.5,22.07)
  Bottom Layer w0.254: U8.43 12.09,55.84 v1(12.57,55.35)
HS: length 8.2
  Top Layer w0.254: U1.4 27.41,27.5 Q2.5
  Top Layer w0.508: C4.1 C3.1 29.02,23.34 U1.4
  vias: v1(23.19,31.52) v1(23.19,30.51) v1(23.19,29.49) v1(23.19,28.48) v1(23.19,27.46) v1(24.21,31.52) v1(24.21,30.51) v1(24.21,29.49) v1(24.21,28.48) v1(24.21,27.46) v1(25.22,31.52) v1(25.22,30.51) v1(25.22,29.49) v1(25.22,28.48) v1(25.22,27.46) v1(26.24,31.52) v1(26.24,30.51) v1(26.24,29.49) v1(26.24,28.48) v1(26.24,27.46) v1(37.95,32.97) v1(37.95,31.95) v1(37.95,30.94) v1(37.95,29.92) v1(37.95,28.91) v1(37.95,27.89) v1(38.96,32.97) v1(38.96,31.95) v1(38.96,30.94) v1(38.96,29.92) v1(38.96,28.91) v1(38.96,27.89) v1(39.98,32.97) v1(39.98,31.95) v1(39.98,30.94) v1(39.98,29.92) v1(39.98,28.91) v1(39.98,27.89)
I2C1_SCL: length 50.6
  Inner2 w0.254: v1(13.51,58.52) 13.51,62.12 14.73,63.35 29.46,63.35 32.77,60.05 47.62,60.05 50.22,62.64 53.16,62.64 H1.2
  Bottom Layer w0.254: U8.51 12.74,59.28 v1(13.51,58.52)
I2C1_SDA: length 41.1
  Inner2 w0.254: v1(17.24,58.78) 17.24,59.89 19.94,62.59 28.07,62.59 31.62,59.03 50.16,59.03 H1.1
  Bottom Layer w0.254: U8.60 v1(17.24,58.78)
LO: length 5.7
  Top Layer w0.254: Q2.4 21.13,27.59 19.3,25.76 R2.2
PA6: length 30.4
  Bottom Layer w0.254: U8.20 17.74,43.83 21.84,39.73 27.81,39.73 36.41,48.32 U2.8
PA7: length 13.9
  Bottom Layer w0.254: U8.21 17.24,43.76 14.1,40.62 14.1,38.2 15.17,37.13 U7.6
PA13: length 43.2
  Top Layer w0.254: v1(45.59,63.22) DIO.1
  Inner1 w0.254: v1(11.74,57.89) 11.74,62.52 12.7,63.48 41.91,63.48 42.67,64.24 44.58,64.24 v1(45.59,63.22)
  Bottom Layer w0.254: U8.49 v1(11.74,57.89)
PA14: length 38.3
  Top Layer w0.254: v1(43.05,63.22) CLK.1
  Inner1 w0.254: v1(43.05,63.22) 42.42,62.59 21.21,62.59 20.07,61.44 13.46,61.44 12.45,60.43 12.45,58.27 v1(12.83,57.89)
  Bottom Layer w0.254: U8.50 12.24,58.47 v1(12.83,57.89)
PB8-BOOT0: length 2.1
  Bottom Layer w0.254: U8.61 17.74,61.66 R31.1
PB9: length 10.6
  Top Layer w0.254: C52.2 18.77,64.11 SW1.1 ; SW1.1 17.75,62.59 v1(18.54,62.59) ; SW1.1 16.94,62.28 R54.2
  Bottom Layer w0.254: v1(18.54,62.59) 18.24,62.29 U8.62
PC4: length 19.2
  Inner2 w0.254: v1(8.38,50.14) 12.95,50.14 14.73,51.92 16.13,51.92 v1(17.14,50.9)
  Bottom Layer w0.254: v1(17.14,50.9) 16.74,50.5 U8.22 ; TX.1 6.6,51.92 v1(8.38,50.14)
PC5: length 17.6
  Inner2 w0.254: v1(7.37,49.12) 13.84,49.12 v1(15.62,50.9)
  Bottom Layer w0.254: RX.1 4.32,49.12 v1(7.37,49.12) ; v1(15.62,50.9) 16.24,50.28 U8.23
PC10: length 15.9
  Top Layer w0.152: v1(7.62,62.84) 7.62,64.11
  Top Layer w0.254: 4.06,61.37 4.06,62.36 SW3.1 5.82,64.11 C54.2
  Bottom Layer w0.152: U8.52 13.24,61.53 11.94,62.84 v1(7.62,62.84)
PC11: length 11.8
  Top Layer w0.152: v1(12.95,62.77) 12.88,62.84 SW2.1
  Top Layer w0.254: R55.2 10.47,62.28 SW2.1 12.29,64.11 C53.2
  Bottom Layer w0.152: v1(12.95,62.77) 13.74,61.97 U8.53
PF0-OSC_IN: length 3.2
  Bottom Layer w0.254: 23.29,56.34 23.24,56.38 C34.2 ; 23.29,56.34 R43.2 ; 23.29,56.34 U8.5
PG10-NRST: length 23.8
  Top Layer w0.254: v1(30.21,61.57) 29.62,61.57 SW4.1 ; SW4.1 29.6,62.85 30.86,64.11 C55.2 ; SW4.1 27.74,63.46 R57.2
  Bottom Layer w0.152: v1(30.21,61.57) 30.21,57.49 29.34,56.62 27.18,56.62 25.53,54.97 22.73,54.97 22.36,55.34 U8.7
VREF+: length 3.8
  Bottom Layer w0.254: U8.28 13.74,47.27 C11.2 14,46.92 15.15,45.78 U4.2
$1N971: length 5
  Top Layer w0.254: R1.2 25.53,23.84 25.53,22.58 26.03,22.07 U1.3
$1N1088: length 3.9
  Top Layer w0.254: U1.8 20.07,19.53 19.3,20.3 R2.1
$1N1274: length 3.9
  Top Layer w0.508: C4.2 C3.2 29.02,20.8 U1.2
$1N3971: length 25.4
  Bottom Layer w0.254: U5.2 26.29,53.01 C12.1 R6.1 26.47,54.73 26.78,55.05 26.78,55.47 27.45,56.14 31.28,56.14 32.8,54.62 39.59,54.62 41.22,56.25 44.19,56.25 R46.2
$1N3972: length 24.7
  Bottom Layer w0.254: U5.3 27.56,53.14 C13.2 R7.2 27.51,54.73 27.19,55.05 27.19,55.3 27.62,55.73 31.11,55.73 32.63,54.21 39.76,54.21 41.39,55.84 44.19,55.84 R48.2
$1N3974: length 51.5
  Inner1 w0.254: v1(23.52,41.93) 22.96,41.93 22.78,41.75 14.47,41.75 11.66,38.94 11.66,21.41 18.66,14.41 18.66,14.16 18.48,13.98 v1(18.48,13.42)
  Bottom Layer w0.254: U5.6 27.56,44.5 R10.1 C14.1 27.1,42.5 27.42,42.19 27.42,41.93 27.24,41.75 24.26,41.75 24.08,41.93 v1(23.52,41.93) ; v1(18.48,13.42) 17.4,14.5 R52.1
$1N3975: length 51.6
  Inner1 w0.254: v1(23.52,41.17) 22.96,41.17 22.78,41.35 14.64,41.35 12.06,38.77 12.06,21.58 19.06,14.58 19.06,14.16 19.24,13.98 v1(19.24,13.42)
  Bottom Layer w0.254: U5.5 28.83,45.24 28.14,44.55 R11.2 C15.2 28.14,42.5 27.83,42.19 27.83,41.77 27.41,41.35 24.26,41.35 24.08,41.17 v1(23.52,41.17) ; R50.1 20.32,14.5 v1(19.24,13.42)
$1N4175: length 2.5
  Bottom Layer w0.254: U6.1 32.3,50.4 R13.1 R12.2
$1N6069: length 1.7
  Bottom Layer w0.254: R43.1 24.18,57.36 X1.3
$1N8242: length 1.6
  Bottom Layer w0.254: 4.85,42.65 4.85,41.81 R44.1
$1N11631: length 1.3
  Bottom Layer w0.254: R45.2 48.52,57.76 R46.1
$1N11681: length 1.3
  Bottom Layer w0.254: R48.1 48.51,54.32 R47.2
$1N11805: length 1.3
  Bottom Layer w0.254: R52.2 R51.1
$1N17930: length 1.3
  Bottom Layer w0.254: R50.2 R49.1
$1N24564: length 1.1
  Top Layer w0.254: R42.1 2.14,59.74 LED1.2

## Copper pours and planes (outline as drawn; the poured copper is in the pictures)
1V65 on Bottom Layer: 33.66,48.93 32.94,48.21 31.66,48.21 31.32,47.87 31.32,44.12 33.66,46.46
3V3 on Bottom Layer: 8.89,42.65 8.89,45.93 10.56,47.6 11.68,47.6 11.94,47.86 11.94,49.25 9.53,49.25 6.1,45.82 6.1,44.31 6.53,43.87 6.76,43.87 7.97,42.67 8.87,42.67
3V3 on Inner1: 22.99,54.97 27.94,54.97 34.11,61.14 34.11,62.33 21.84,62.33 20.45,60.94 20.45,57.51
3V3 on Inner1: 6.6,56.62 6.6,45.95 7.24,45.31 9.78,45.31 12.57,48.11 21.97,48.11 23.11,49.25 23.11,60.17 21.97,61.32 8.22,61.32 7.61,60.71 7.61,57.62
5V0 on Bottom Layer: 16.64,39.35 17.14,39.85 18.03,39.85 18.41,39.47 18.41,38.61 17.3,38.61 17.14,38.46 16.64,38.46 16.64,38.46
5V0 on Bottom Layer: 6.27,40.98 8.65,40.98 8.84,41.17 8.84,42.09 8.59,42.34 7.93,42.34 6.98,43.28 6.48,43.28 6.35,43.16 6.35,41.85 6,41.5 6,41.25
5V0 on Bottom Layer: 21.59,9.63 21.59,12.93 22.1,13.44 23.11,13.44 23.62,12.93 23.62,9.88 23.37,9.63
5V0 on Bottom Layer: 11.98,44.95 13.08,46.05 13.66,46.05 13.97,45.73 13.97,44.43 13.59,44.05 12.89,44.05
5V0 on Inner1: -0.38,65 41.4,65 41.4,37.44 -0.38,37.44
5V0 on Inner1: 10.92,37.57 10.92,20.42 17.65,13.69 22.48,13.69 23.24,12.93 23.24,10.52 22.48,9.75 0,9.75 0,37.69 10.8,37.69
12V0 on Top Layer: 29.97,20.17 29.97,17.63 29.84,17.5 26.73,17.5 26.16,18.07 26.16,19.79 26.54,20.17
12V0 on Top Layer: 32.13,5.44 30.99,6.58 28.96,6.58 27.81,5.44
12V0 on Bottom Layer: 24.37,9.45 28.5,9.45 31.62,6.33 31.62,5.31 30.86,4.55 24.13,4.55 24,4.68 24,7.47 23.5,7.98 23.5,8.57
12V0 on Inner1: 29.01,19.53 29.53,19.02 29.53,18.43 28.52,17.42 28.02,17.42 26.92,18.52 26.92,19.05 27.41,19.53
AGND on Top Layer: 21.97,28.42 21.97,26.77 23.24,25.5 32.26,25.5 32.77,25 32.77,17.38 31.5,16.11 20.09,16.11 18.06,18.14 18.06,28.83 18.29,29.06 21.34,29.06
AGND on Top Layer: 27.81,11.15 28.96,10.01 30.99,10.01 32.13,11.15
AGND on Top Layer: 54.61,55.86 52.7,53.95 33.15,53.95 27.18,47.98 27.18,34.27 25.53,32.61 22.86,32.61 22.1,31.85 22.1,28.42 21.84,28.17 18.92,28.17 18.16,28.93 18.16,60.3 20.95,63.09 47.82,63.09 51.76,59.16 53.21,59.16 54.61,57.76
AGND on Top Layer: 18.41,60.3 11.81,60.3 6.73,55.22 6.73,39.62 10.53,35.82 13.69,35.82 18.41,31.09
AGND on Top Layer: 4.19,11.15 5.33,10.01 7.37,10.01 8.51,11.15
AGND on Top Layer: 35.43,54.71 37.21,52.94 37.21,49.89 33.91,46.59 33.91,43.16 35.05,42.01 39.62,42.01 41.28,43.66 41.28,51.28 44.7,54.71
AGND on Bottom Layer: 18.41,36.3 19.69,37.57 22.61,37.57 24.13,36.04 24.13,34.27 22.35,32.49 18.8,32.49 18.41,32.87
AGND on Bottom Layer: 0,14.96 33.27,14.96 34.16,14.07 34.16,0 0,0
AGND on Inner1: 18.41,36.3 19.69,37.57 23.75,37.57 24.51,36.81 24.51,34.65 22.35,32.49 21.46,32.49 18.41,35.54
AGND on Inner2: 18.41,36.3 19.69,37.57 22.61,37.57 24.13,36.04 24.13,34.27 22.35,32.49 21.34,32.49 18.41,35.41
AGND on Inner2: -0.13,23.85 31.37,23.85 34.16,21.06 34.16,0 -0.13,0
GND on Bottom Layer: 38.99,43.79 38.99,50.65 40.39,49.25 42.29,49.25 43.31,48.24 43.31,46.25 42.28,45.23 40.42,45.23
GND on Bottom Layer: -0.25,64.62 40.39,64.62 40.39,38.46 -0.25,38.46
GND on Bottom Layer: 18.74,37.77 20.07,39.09 13.72,39.09 15.04,37.77
GND on Inner2: -0.25,65 40.51,65 40.51,38.71 -0.25,38.71
VBUS on Top Layer: 58.04,29.82 59.44,31.22 62.86,31.22 64.26,29.82 64.26,24.87 63.25,23.85 59.06,23.85 58.04,24.87
VBUS on Top Layer: 34.18,26.17 34.71,26.17 36.32,27.79 36.32,40.23 33.4,43.16 33.4,47.22 36.45,50.27 36.45,52.29 35.68,53.06 33.53,53.06 27.94,47.47 27.94,34.14 30.1,31.98 30.1,26.9 30.86,26.14 34.14,26.14
VBUS on Bottom Layer: 14.35,26.27 11.94,23.85 11.94,23.04 10.54,24.43 10.54,31.22 11.43,32.11 13.72,32.11 14.35,31.47
VBUS on Bottom Layer: 33.18,17.43 38.08,22.33 19.94,22.33 24.84,17.43
VBUS on Bottom Layer: 64.26,25.63 64.26,28.55 62.36,30.46 50.02,30.46 45.99,26.43 36.8,26.43 34.92,28.3 34.92,31.6 34.29,32.23 30.73,32.23 30.1,31.6 30.1,25.88 34.04,21.95 60.58,21.95
VBUS on Bottom Layer: 30.17,29.49 26.69,26.01 22.99,26.01 21.96,27.04 21.96,30.48 20.34,32.09 13.7,32.09 12.7,31.09 12.7,27.38 14.07,26.01 16.26,26.01 20.32,21.95 34.04,21.95 34.04,25.62
VBUS on Inner1: 34.06,31.96 34.53,31.5 34.53,21.84 32.31,19.61 21.64,19.61 18.41,22.84 18.41,23.98 17.02,25.38 15.38,25.38 12.95,27.8 12.95,30.71 15.49,33.25 19.88,33.25 21.32,31.81 21.32,27.29 23.37,25.25 26.54,25.25 30.35,29.06 30.35,31.54 30.78,31.96
AC_CS+ on Bottom Layer: 60.07,44.68 58.67,46.08 56.39,46.08 54.48,44.17 51.66,44.17 51.15,44.68 51.15,52.84 50.8,53.19 46.86,53.19 45.09,51.41 45.09,49.38 47.36,49.38 49.13,47.6 49.13,43.04 51.67,40.51 58.62,40.51 60.07,41.96
AC_CS- on Top Layer: 46.35,46.71 47.99,45.07 47.99,41.25 47.1,40.36 43.18,40.36 42.28,41.26 42.28,45.62 43.37,46.71
AC_CS- on Top Layer: 42.29,45.57 42.29,50.52 43.31,51.54 46.48,51.54 47.37,50.65 47.37,45.57
AC_CS- on Bottom Layer: 48.39,45.31 48.39,41.12 47.5,40.23 43.33,40.23 42.31,41.25 42.31,44.32 43.31,45.31
AC_N on Top Layer: 56.39,54.2 54.17,51.99 50.24,51.99 48.51,50.27 48.51,44.3 49.66,43.16 53.01,43.16 56.41,46.55 58.77,46.55 60.58,48.36 60.58,52.55 58.93,54.2
AC_N on Bottom Layer: 59.82,52.05 58.04,53.82 52.07,53.82 52.07,45.15 52.61,44.6 54.41,44.6 56.39,46.59 58.04,46.59 59.82,48.36
DC_CS- on Bottom Layer: 14.48,32.87 11.3,32.87 10.03,31.6 9.14,31.6 8.76,31.22 8.76,22.96 9.27,22.45 12.06,22.45 12.45,22.84 12.45,23.72 14.35,25.63 16.13,25.63 18.41,23.34 18.41,21.31 13.97,16.87 2.67,16.87 -0.38,19.92 -0.38,33.76 2.67,36.81 13.84,36.81 14.48,36.17
HS on Top Layer: 26.96,31.94 29.5,31.94 29.72,31.73 29.72,28.42 29.46,28.17 28.19,28.17 27.94,27.92 27.94,27.28 27.69,27.03 26.96,27.03
HS on Top Layer: 46.86,33.25 46.1,34.01 37.85,34.01 37.21,33.38 37.21,27.15 37.72,26.65 46.1,26.65 46.86,27.41
HS on Bottom Layer: 41.4,28.06 41.4,35.41 39.62,37.19 27.94,37.19 22.48,31.73 22.48,27.03 23.37,26.14 26.42,26.14 29.84,29.57 29.84,31.73 30.61,32.49 34.62,32.49 35.27,31.84 35.27,28.84 37.21,26.9 40.25,26.9
HS on Inner1: 41.4,28.06 41.4,35.41 40.26,36.55 27.31,36.55 22.48,31.73 22.48,27.03 23.37,26.14 26.42,26.14 29.84,29.57 29.84,31.73 30.61,32.49 34.62,32.49 35.27,31.84 35.27,28.84 37.21,26.9 40.25,26.9
HS on Inner2: 41.4,28.06 41.4,35.41 39.75,37.06 27.81,37.06 22.48,31.73 22.48,27.03 23.37,26.14 26.42,26.14 29.84,29.57 29.84,31.73 30.61,32.49 34.62,32.49 35.27,31.84 35.27,28.84 37.21,26.9 40.25,26.9
$1N1915 on Top Layer: 42.16,38.97 42.93,39.73 54.61,39.73 55.75,38.58 63.37,38.58 64.26,37.7 64.26,34.65 63.12,33.5 59.06,33.5 57.53,31.98 57.53,28.3 56.13,26.9 50.67,26.9 48.77,28.81 48.77,33.12 46.61,35.28 43.04,35.28 42.16,36.16

Small or netless copper shapes (teardrops, artwork), in the pictures only: 99 on Top Layer, 147 on Bottom Layer, 15 on Inner1, 14 on Inner2

## Text on the board
Bottom Silkscreen Layer: JLCJLCJLCJLC
Top Silkscreen Layer: RST | SDA | SCL | 5V0 | GND | AC IN | DC OUT
